# EAGLE schematic X12 Power Distribuition (EAGLE 9.5.0)
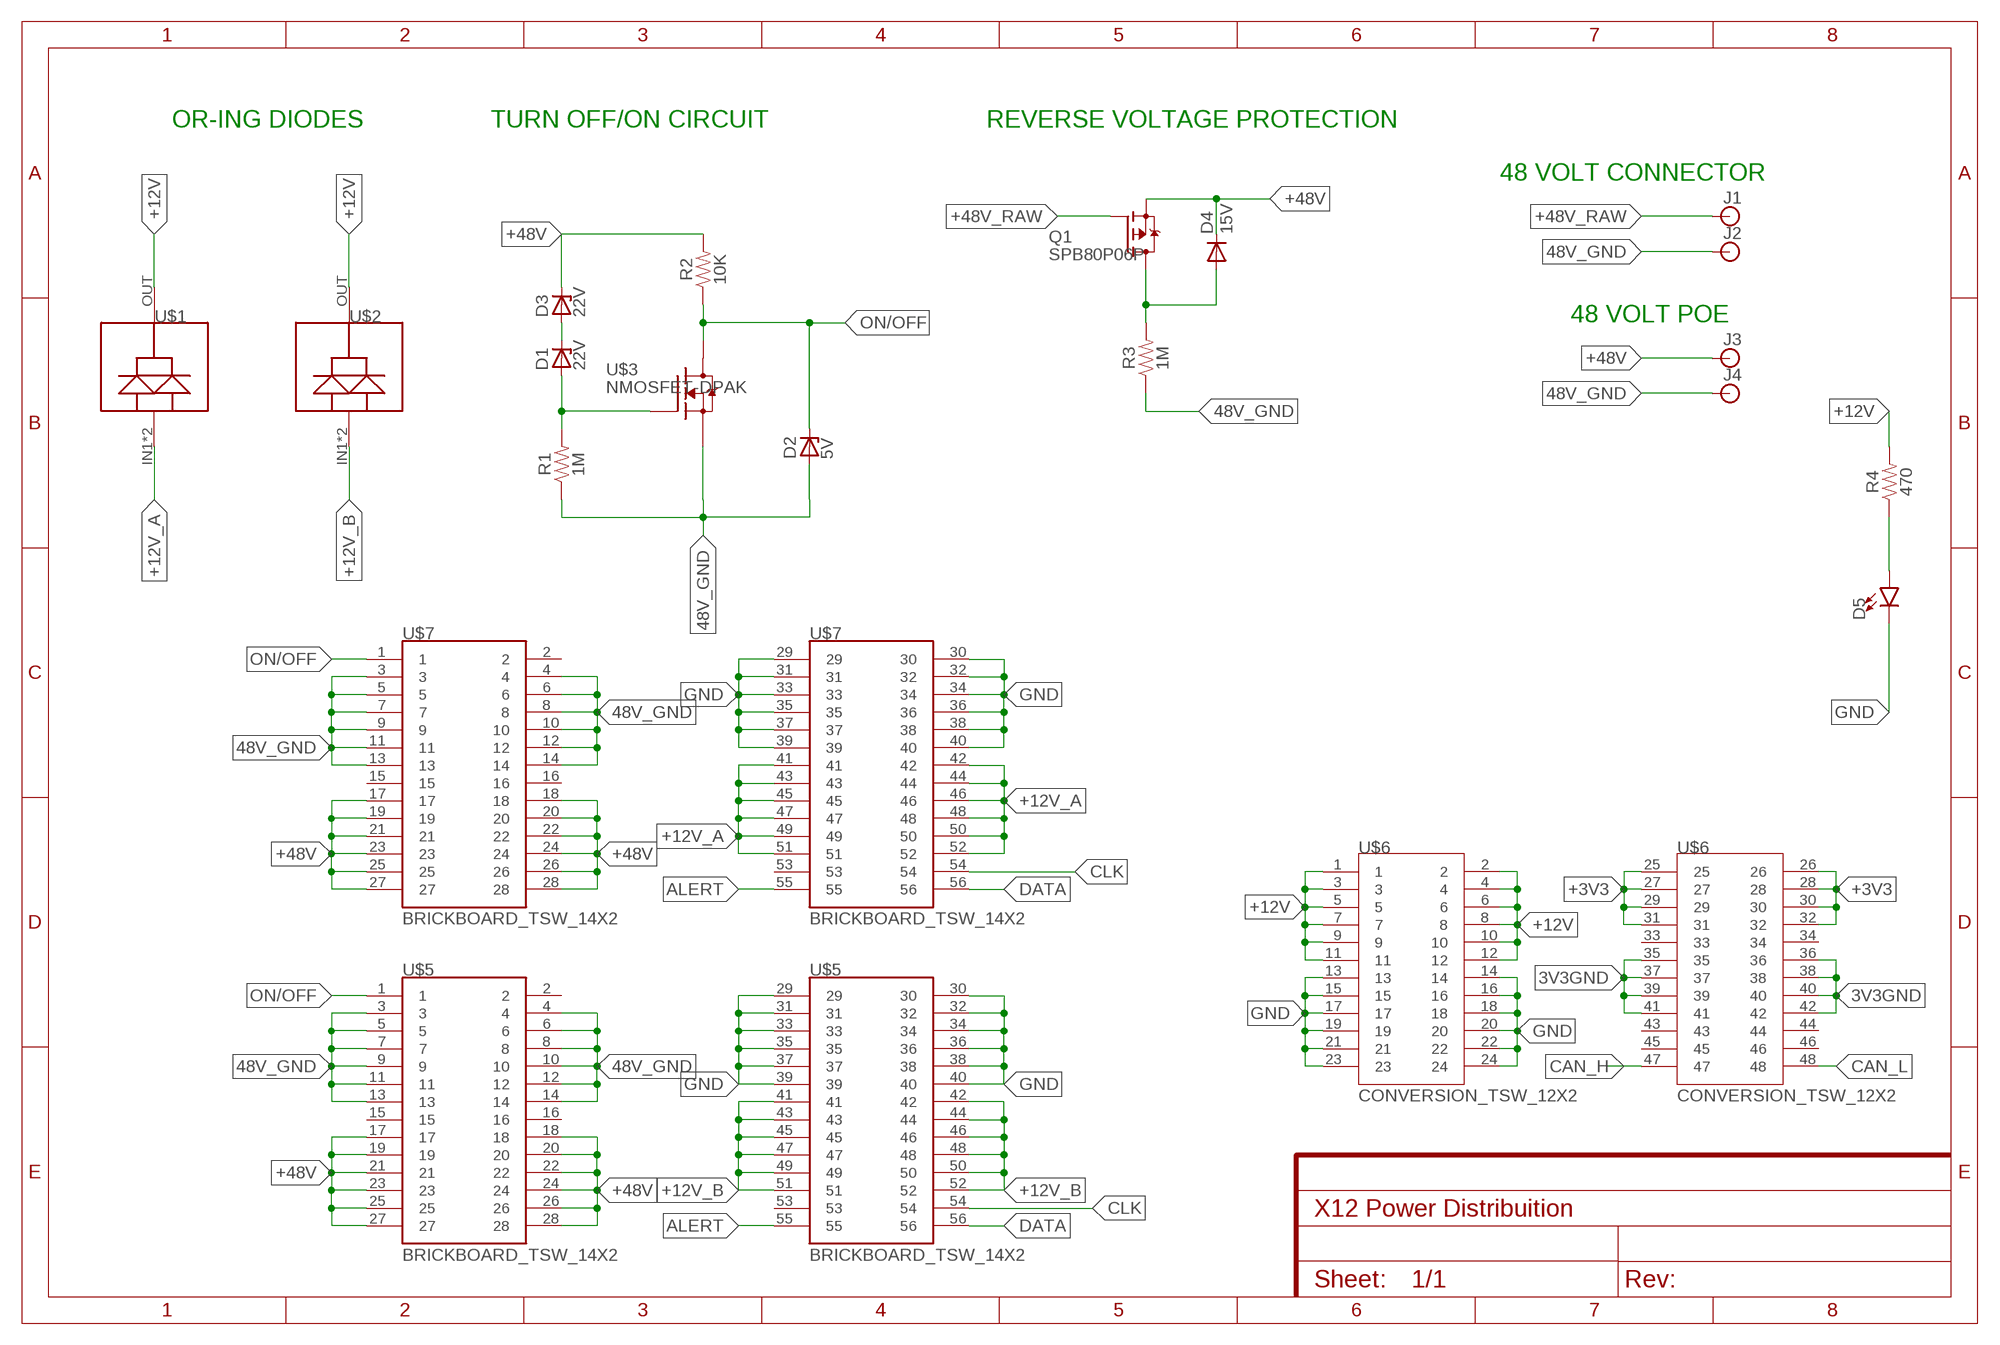
[diagram p0: schematic, sheet 1, part 1 of 2]
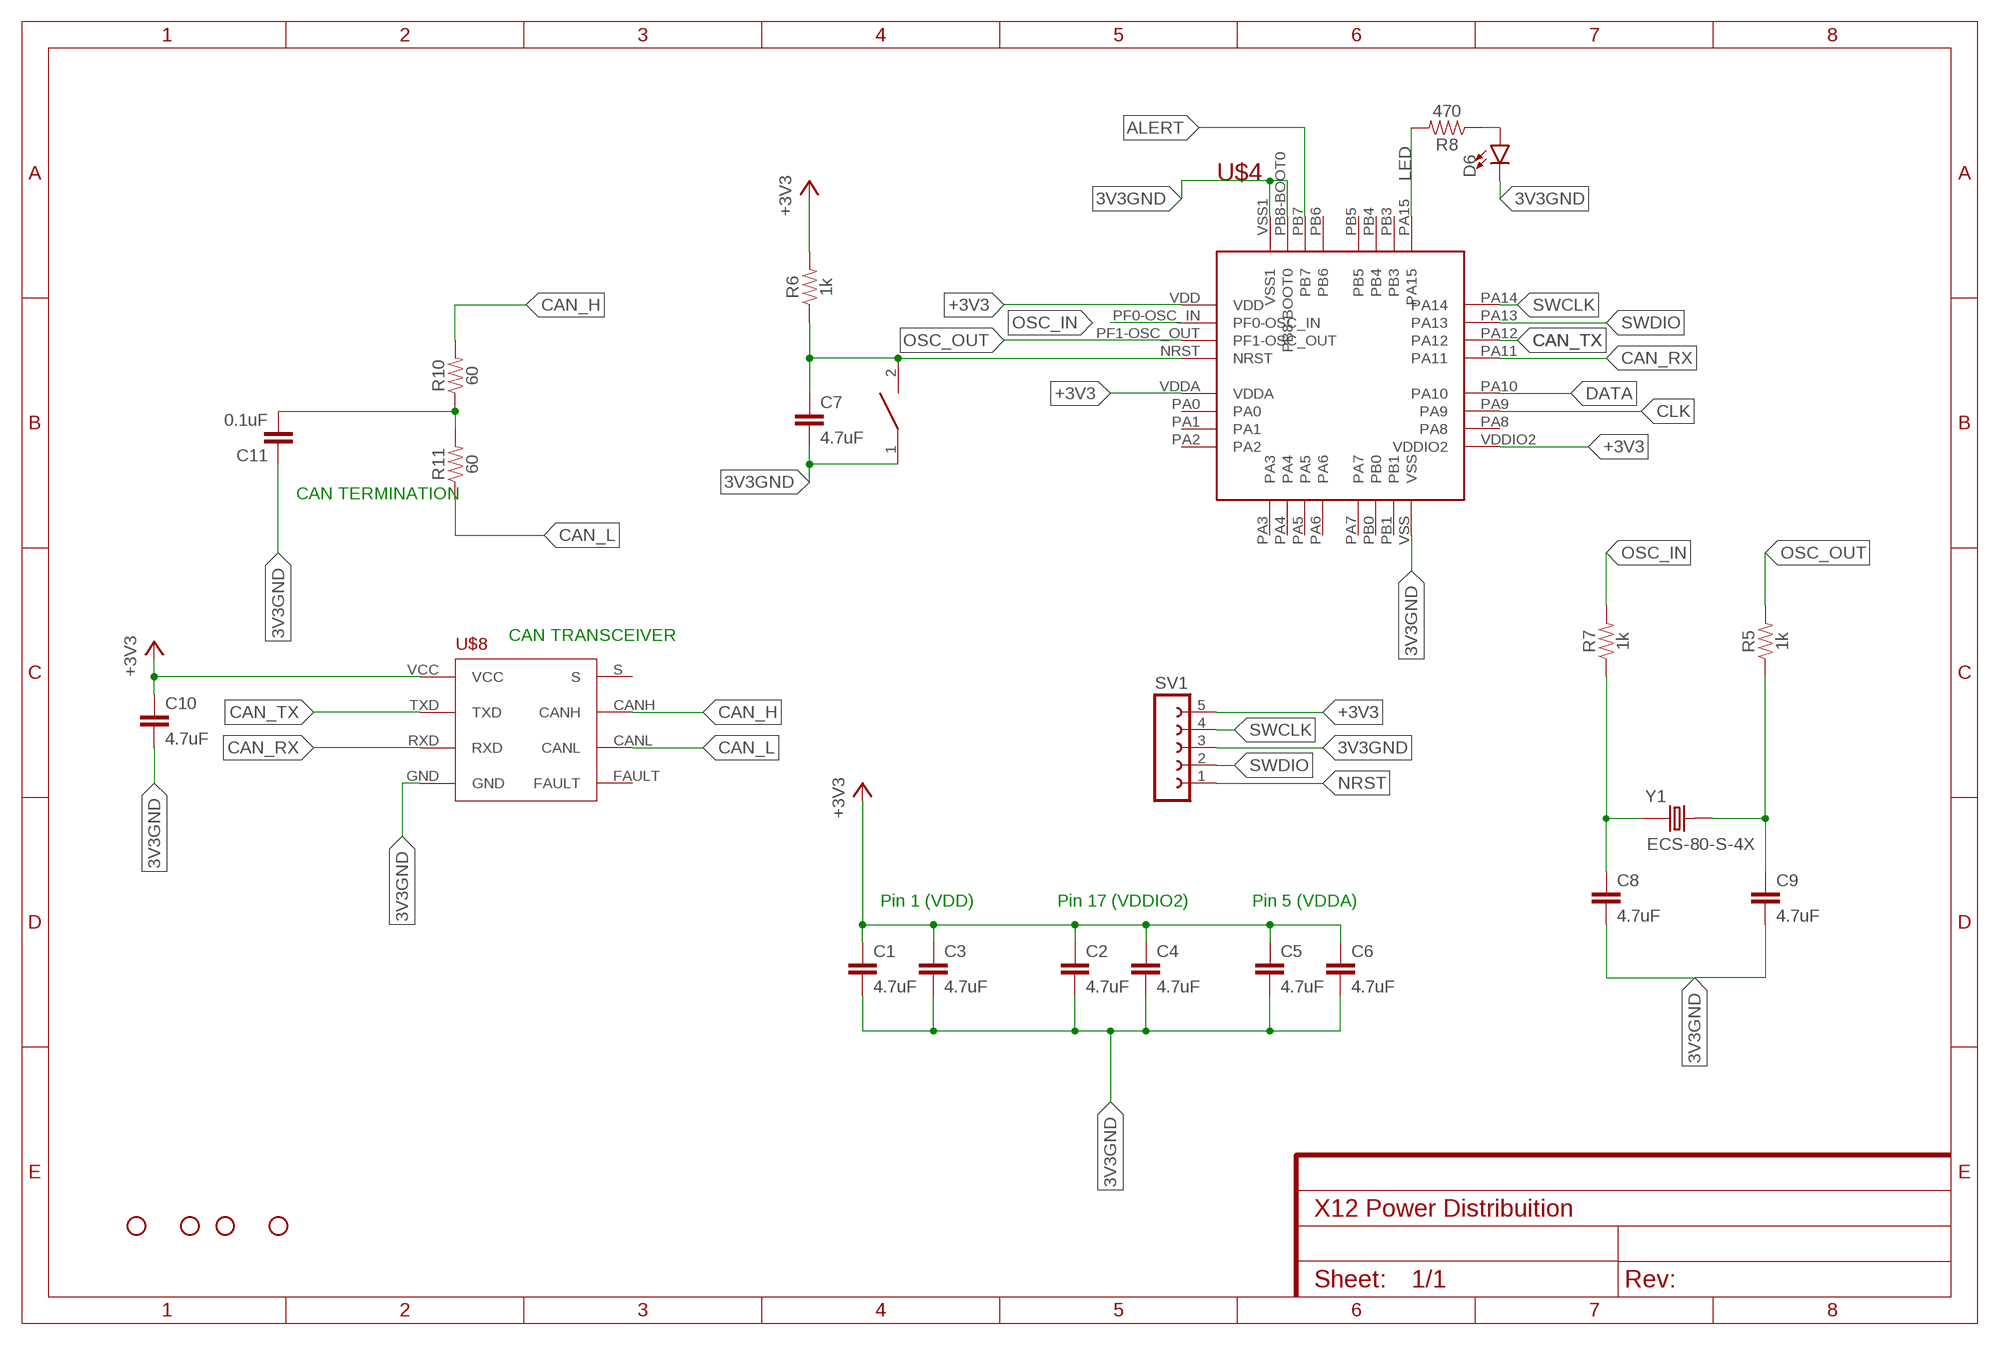
[diagram p1: schematic, sheet 1, part 2 of 2]

## Parts
C1  4.7uF  4.7UF0603  [0603]
C2  4.7uF  4.7UF0603  [0603]
C3  4.7uF  4.7UF0603  [0603]
C4  4.7uF  4.7UF0603  [0603]
C5  4.7uF  4.7UF0603  [0603]
C6  4.7uF  4.7UF0603  [0603]
C7  4.7uF  4.7UF0603  [0603]
C8  4.7uF  4.7UF0603  [0603]
C9  4.7uF  4.7UF0603  [0603]
C10  4.7uF  4.7UF0603  [0603]
C11  0.1uF  0.1UF-0603-25V-(+80/-20%)  [0603]
D1  22V  ZENER-DIODESOT23  [SOT23]
D2  5V  ZENER-DIODESOT23  [SOT23]
D3  22V  ZENER-DIODESOT23  [SOT23]
D4  15V  DIODE-SOD123  [SOD123]
D5  LED0603  [LED-0603]
D6  LED0603  [LED-0603]
H1  STAND-OFF  [STAND-OFF]
H2  STAND-OFF  [STAND-OFF]
H3  STAND-OFF  [STAND-OFF]
H4  STAND-OFF  [STAND-OFF]
J1  BANANA_CONN  [BANANA_CONN]
J2  BANANA_CONN  [BANANA_CONN]
J3  BANANA_CONN  [BANANA_CONN]
J4  BANANA_CONN  [BANANA_CONN]
Q1  SPB80P06P  [TO263]
R1  1M  RESISTOR0603  [0603]
R2  10K  RESISTOR0603  [0603]
R3  1M  RESISTOR0603  [0603]
R4  470  RESISTOR0603  [0603]
R5  1k  1KOHM-0603-1/10W-1%  [0603]
R6  1k  1KOHM-0603-1/10W-1%  [0603]
R7  1k  1KOHM-0603-1/10W-1%  [0603]
R8  470  RESISTOR0603  [0603]
R10  60  1KOHM-0603-1/10W-1%  [0603]
R11  60  1KOHM-0603-1/10W-1%  [0603]
RESET  SWITCH  [SW_2512]
SV1  FE05-1  [FE05-1]
U$1  DIODE  [DIODE]
U$2  DIODE  [DIODE]
U$3  NMOSFET-DPAK  [DPAK]
U$4  STM32F042K6T6  [STM32F042K6T6]
U$5  BRICKBOARD_TSW_14X2  [BRICKBOARD_TSW_14X2]
U$6  CONVERSION_TSW_12X2  [CONVERSION_TSW_12X2]
U$7  BRICKBOARD_TSW_14X2  [BRICKBOARD_TSW_14X2]
U$8  TCAN337D  [TCAN337D]
Y1  ECS-80-S-4X  [XTAL_ECS-80-S-4X]

## Nets
3V3GND: C1.2 C2.2 C3.2 C4.2 C5.2 C6.2 C7.2 C8.2 C9.2 C10.2 C11.1 D6.C RESET.1 SV1.3 U$4.PB8-BOOT0 U$4.VSS U$4.VSS1 U$6.35 U$6.36 U$6.37 U$6.38 U$6.39 U$6.40 U$6.41 U$6.42 U$8.GND
48V_GND: D2.1(A) J2.P$1 J4.P$1 R1.1 R3.1 U$3.3(S) U$5.3 U$5.4 U$5.5 U$5.6 U$5.7 U$5.8 U$5.9 U$5.10 U$5.11 U$5.12 U$5.13 U$5.14 U$7.3 U$7.4 U$7.5 U$7.6 U$7.7 U$7.8 U$7.9 U$7.10 U$7.11 U$7.12 U$7.13 U$7.14
+3V3: C1.1 C2.1 C3.1 C4.1 C5.1 C6.1 C10.1 R6.2 SV1.5 U$4.VDD U$4.VDDA U$4.VDDIO2 U$6.25 U$6.26 U$6.27 U$6.28 U$6.29 U$6.30 U$6.31 U$6.32 U$8.VCC
+12V: R4.2 U$1.OUT U$2.OUT U$6.1 U$6.2 U$6.3 U$6.4 U$6.5 U$6.6 U$6.7 U$6.8 U$6.9 U$6.10 U$6.11 U$6.12
+12V_A: U$1.IN1(IN2) U$1.IN2 U$7.41 U$7.42 U$7.43 U$7.44 U$7.45 U$7.46 U$7.47 U$7.48 U$7.49 U$7.50 U$7.51 U$7.52
+12V_B: U$2.IN1(IN2) U$2.IN2 U$5.41 U$5.42 U$5.43 U$5.44 U$5.45 U$5.46 U$5.47 U$5.48 U$5.49 U$5.50 U$5.51 U$5.52
+48V: D3.3(C) D4.C J3.P$1 Q1.2(S) R2.2 U$5.17 U$5.18 U$5.19 U$5.20 U$5.21 U$5.22 U$5.23 U$5.24 U$5.25 U$5.26 U$5.27 U$5.28 U$7.17 U$7.18 U$7.19 U$7.20 U$7.21 U$7.22 U$7.23 U$7.24 U$7.25 U$7.26 U$7.27 U$7.28
+48V_RAW: J1.P$1 Q1.1(G)
ALERT: U$4.PB7 U$5.55 U$7.55
CAN_H: R10.2 U$6.47 U$8.CANH
CAN_L: R11.1 U$6.48 U$8.CANL
CAN_RX: U$4.PA11 U$8.RXD
CAN_TX: U$4.PA12 U$8.TXD
CLK: U$4.PA9 U$5.54 U$7.54
DATA: U$4.PA10 U$5.56 U$7.56
GND: D5.C U$5.29 U$5.30 U$5.31 U$5.32 U$5.33 U$5.34 U$5.35 U$5.36 U$5.37 U$5.38 U$5.39 U$5.40 U$6.13 U$6.14 U$6.15 U$6.16 U$6.17 U$6.18 U$6.19 U$6.20 U$6.21 U$6.22 U$6.23 U$6.24 U$7.29 U$7.30 U$7.31 U$7.32 U$7.33 U$7.34 U$7.35 U$7.36 U$7.37 U$7.38 U$7.39 U$7.40
LED: R8.2 U$4.PA15
N$1: D1.3(C) D3.1(A)
N$2: D1.1(A) R1.2 U$3.1(G)
N$3: D4.A Q1.3(D) R3.2
N$4: D5.A R4.1
N$5: C11.2 R10.1 R11.2
N$6: C9.1 R5.1 Y1.2
N$7: C8.1 R7.1 Y1.1
N$24: D6.A R8.1
NRST: C7.1 R6.1 RESET.2 SV1.1 U$4.NRST
ON/OFF: D2.3(C) R2.1 U$3.4(D1) U$5.1 U$7.1
OSC_IN: R7.2 U$4.PF0-OSC_IN
OSC_OUT: R5.2 U$4.PF1-OSC_OUT
SWCLK: SV1.4 U$4.PA14
SWDIO: SV1.2 U$4.PA13
Unconnected: U$4.PA0 U$4.PA1 U$4.PA2 U$4.PA3 U$4.PA4 U$4.PA5 U$4.PA6 U$4.PA7 U$4.PA8 U$4.PB0 U$4.PB1 U$4.PB3 U$4.PB4 U$4.PB5 U$4.PB6 U$5.2 U$5.15 U$5.16 U$5.53 U$6.33 U$6.34 U$6.43 U$6.44 U$6.45 U$6.46 U$7.2 U$7.15 U$7.16 U$7.53 U$8.FAULT U$8.S

## Notes on the sheet
- OR-ING DIODES | TURN OFF/ON CIRCUIT | REVERSE VOLTAGE PROTECTION
- 48 VOLT CONNECTOR
- 48 VOLT POE
- CAN TERMINATION
- CAN TRANSCEIVER
- Pin 1 (VDD) | Pin 17 (VDDIO2) | Pin 5 (VDDA)

## Library data of the parts
C1-C10 = SparkFun-Capacitors:4.7UF: 4.7µF ceramic capacitors A capacitor is a passive two-terminal electrical component used to store electrical energy temporarily in an electric field.; PROD_ID: CAP-08280
C11 = SparkFun-Capacitors:0.1UF: 0.1µF ceramic capacitors A capacitor is a passive two-terminal electrical component used to store electrical energy temporarily in an electric field.; PROD_ID: CAP-00810
D1-D3 = diode:ZENER-DIODE: Z-Diode
D4 = diode:DIODE-: DIODE
D5 D6 = SparkFun-LED:LED: LED (Generic) Standard schematic elements and footprints for 5mm, 3mm, 1206, and 0603 sized LEDs. Generic LEDs with no color specified.
H1-H4 = SparkFun-Hardware:STAND-OFF: Stand Off Drill holes for mechanically mounting via screws, standoffs, etc. Note: Use the keepout ring to avoid running the screw head into surrounding components. Variant Overviews STAND-OFF - Mechanical footprint for a #4 phillips button head screw. STAND-OFF-TIGHT - Mechanical footprint for a #4 phillips button head screw, Example SparkFun Products Screw - Phillips Head (1/4", 4-40, 10 pack) <https://www.sparkfun.com/products/10453> (PRT-10453) Screw - Phillips Head (1/2", 4-40, 10 pack) <https://www.sparkfun.com/products/10452> (PRT-10452) Screw - Phillips Head (3/4", 4-40, 10 pack) <https://www.sparkfun.com/products/10451> (PRT-10451) Screw - Phillips Head (1", 4-40, 10 pack) <https://www.sparkfun.com/products/10450> (PRT-10450)
J1-J4 = SparkFun-Connectors:BANANA_CONN: Through-hole Banana Jack Basic PTH connection for banana jack plugs SparkFun Products: Multimeter Kit <https://www.sparkfun.com/products/retired/10956> Banana to Alligator Cable <https://www.sparkfun.com/products/retired/509> Banana to Alligator Coax Cable <https://www.sparkfun.com/products/retired/508> Banana to Banana Cable <https://www.sparkfun.com/products/retired/507> Banana to IC Hook Cables <https://www.sparkfun.com/products/retired/506>
Q1 = transistor-fet:SPB80P06P: SIPMOS (R) Power-Transistor P-Channel, Enhancement mode Source: http://www.infineon.com/upload/Document/cmc_upload/documents/011/3685/SPP80P06P.pdf
R1-R3 = SparkFun-Resistors:RESISTOR: Generic Resistor Package; SPICEPREFIX: R
R4 R8 = SparkFun-Resistors:RESISTOR: Generic Resistor Package
R5-R7 = SparkFun-Resistors:1KOHM: 1kΩ resistor A resistor is a passive two-terminal electrical component that implements electrical resistance as a circuit element. Resistors act to reduce current flow, and, at the same time, act to lower voltage levels within circuits. - Wikipedia; PROD_ID: RES-07856
R10 R11 = SparkFun-Resistors:1KOHM: 1kΩ resistor A resistor is a passive two-terminal electrical component that implements electrical resistance as a circuit element. Resistors act to reduce current flow, and, at the same time, act to lower voltage levels within circuits. - Wikipedia; PROD_ID: RES-07856; VALUE: 1k
RESET = DiscreteComponents:SWITCH
SV1 = con-lsta:FE05-1: FEMALE HEADER; OC_FARNELL: unknown; OC_NEWARK: unknown
U$1 U$2 = DIODE:DIODE
U$3 = MotherboardParts:NMOSFET-DPAK; PN-DIGI: 497-4329-1-ND; VDSS: 60V
U$4 = PI_Shield_Library:STM32F042K6T6
U$5 U$7 = Dist_to_Brickboard_Connector:BRICKBOARD_TSW_14X2
U$6 = Dist_to_Conversion_Connector:CONVERSION_TSW_12X2
U$8 = PI_Shield_Library:TCAN337D
Y1 = ECS-80-S-4X:ECS-80-S-4X: CRYSTAL T/H; DESCRIPTION: Crystal 8MHz Series 2-Pin HC-49/U; DIGI-KEY_PART_NUMBER: X1057-ND; DIGI-KEY_PURCHASE_URL: https://www.digikey.com/product-detail/en/ecs-inc/ECS-80-S-4X/X1057-ND/827549?utm_source=snapeda&utm_medium=aggregator&utm_campaign=symbol; MF: ECS International; MP: ECS-80-S-4X; PACKAGE: HC-49/US ECS International